# Altium schematic sheet LED Driver 8W.SchDoc
size 420 x 297 mm; CheckedBy: Lazarev; SheetTotal: 1; PageSetup: Record=PageOptions|CenterHorizontal=True|CenterVertical=True|PrintScale=1.44|XCorrection=1.00|YCorrection=1.00|PrintKind=0|BorderSize=5000000|LeftOffset=0|BottomOffset=0|Orientation=2|PaperLength=1000|PaperWidth=1000|Scale=100|PaperSource=260|PrintQuality=600|MediaType=1|DitherType=10|PrintScaleMode=1|PaperKind=A1|PaperIndex=120
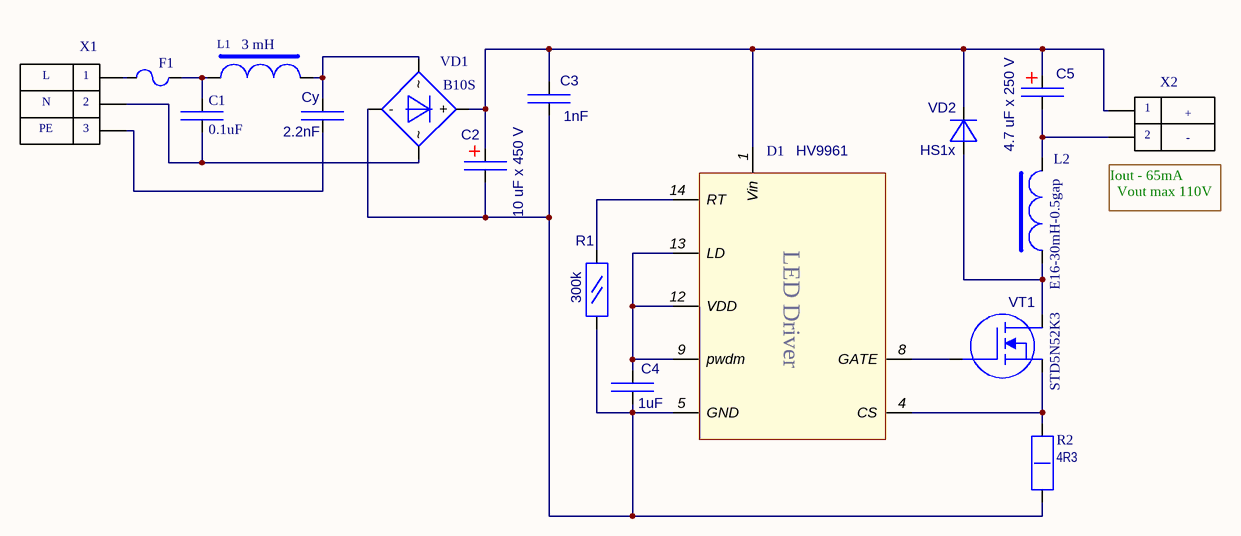
[diagram p0: LED Driver 8W.SchDoc]

## Parts
C1  value 0.1uF  [CAPR6.0x13.0-10.0 (MKP-104K0305AB1101-P)]  (hidden comment: Cap1)
C2  value 10 uF x 450 V  [CAPR E 12.5x20, pitch 5mm; hor.]  (hidden comment: Cap Pol)
C3  value 1nF  [CAPR5.0x13.0-5.0]  (hidden comment: Cap1)
C4  value 1uF  [CAPC2012 (0805)]  (hidden comment: Cap_SMD)
C5  value 4.7 uF x 250 V  [CAPR E 10x12.5 pitch 5 - hor]  (hidden comment: Cap Pol)
Cy  value 2.2nF  [CAPR Y - 7.5]  (hidden comment: Cap (Y))
D1  value HV9961  [SOIC127P602-16BN]  (hidden comment: HV9961 (SO16))
F1  Fuse3  [Fuse - PCB]  (value not drawn)  (net tie, no BOM)
L1  3 mH  [Choke Barbell]
L2  Value2: E16-30mH-0.5gap  [VRI-E16-8-G]  (hidden comment: LED.E16-30mH-0.5g-H)
R1  value 300k  [RESC2012(0805)]  (hidden comment: Res 1/8W)
R2  value 4R3  [RESC6332]  (hidden comment: Res 1W_1)
VD1  value B10S  [DB1-MS]  (hidden comment: Diode Bridge)
VD2  value HS1x  [CD4532-1812 (mod)]  (hidden comment: Diode HS1x)
VT1  Value2: STD5N52K3  [D-PAK (TO252)]  (hidden comment: FQD5N50)
X1  Connector_3_pin  [ZIP-Ballast3]  (value not drawn)
X2  Connector_output_2pin_nobody  [ZIP-Ballast2]  (value not drawn)

## Nets
NetC1_1: C1.1 VD1.2 X1.2
NetC1_2: C1.2 F1.1 L1.1(Pri+)
NetC2_1: C2.1 C3.2 C5.1 D1.1(Vin) VD1.3(+) VD2.2 X2.1
NetC2_2: C2.2 C3.1 C4.2 D1.5(GND) R1.1 R2.2 VD1.4(-)
NetC4_1: C4.1 D1.9(pwdm) D1.12(VDD) D1.13(LD)
NetC5_2: C5.2 L2.1(Pri-) X2.2
NetCy_1: Cy.1 X1.3
NetCy_2: Cy.2 L1.2(Pri-) VD1.1
NetD1_4: D1.4(CS) R2.1 VT1.3(S)
NetD1_8: D1.8(GATE) VT1.1(G)
NetD1_14: D1.14(RT) R1.2
NetF1_1: F1.1 X1.1
NetL2_14: L2.14(Pri+) VD2.1 VT1.2(D)

## Notes on the sheet
- (near X2) Iout - 65mA
  Vout max 110V
- Подп. дата
- Инв. № дубл.
- Взам. инв. №
- Подп. и дата
- Изм.
- Лист.
- № докум.
- Подп.
- Дата
- Лит.
- Масса
- Масштаб
- Разраб.
- Пров.
- Т. контр.
- Лист 1
- Листов
- 1:1
- Инв. № подп.
- Н. контр.
- Утв.
- (in symbol Connector_3_pin) L; N; PE
- (in symbol Connector_output_2pin_nobody) +; -
- (in symbol HV9961 (SO16)) LED Driver

## Library data of the parts
C1 = Cap1: Capacitor GOST; Voltage: 275VAC; Function: EMI X2-class Capacitor; PackageDescription: Radial Capacitor; Package Reference: Thru-Hole, Pin spacing 7.5mm; Part Number: *; Tolerance %: *; Supplier: *; Supplier Part Number: *
C2 C5 = Cap Pol: Cap Pol GOST; Tolerance: 10%; Function: Electrolytic Aluminum Capasitor; Supplier: *
  C2: PackageDescription: Radial, Thru-Hole Body 13.0x25.0 (DxH)mm, Pin Spacing 5.0mm
  C5: PackageDescription: Radial, Thru-Hole Body 10.0x13.5 (DxH)mm, Pin Spacing 5.0mm
C3 = Cap1: Capacitor GOST; Voltage: 1kV; Tolerance: 10 %; Dielectrik: Polypropyline; PackageDescription: Radial Capacitor; Package Reference: Capacitor class X 2,Thru-Hole Body 5.0 x 13.0 mm (WxT) Pin Spacing 5.0 mm; Function: *; Part Number: *; Supplier: *; Supplier Part Number: *
C4 = Cap_SMD: Ceramic; Voltage: 25V; Tolerance %: 10%; Dielectric: X7R; PackageDescription: SMD CC0805; Function: *; Supplier: *; Supplier Part Number: *
Cy = Cap (Y): Disc Ceramic; Voltage: 275VAC/400VDV; Function: Y-capacitor; Tolerance %: 20%; Dielectric: Ceramic Y1-class; PackageDescription: Radial, Disc Body , Pin Spacing 7.5mm; Supplier 1: *; Supplier Part Number 1: *
D1 = HV9961 (SO16): IC LED Driver Buck; Functuion: LED-Driver Controller; PackageReference: SOIC16; Supplier 1: Digi-Key; Supplier 2: Digi-Key; Supplier Part Number 2: HV9961NG-G-M901DKR-ND
F1 = Fuse3: Fuse GOST
L1 = Choke Barbell: Barbell 10 mm(d); PartNumber: IPK1016K302TU; Function: Choke EMI; PackageDescription: Barbell 11mm D; Value: 3 mH
L2 = Choke LED E16: LED.E16-30mH-0.5g.H; Function: Choke Ballast; PackageDescription: EVD25-13; Value: LED.E16-30mH-0.5g-H
R1 = Res 1/8W: Resistor GOST; Tolerance: 5%; PackageDescription: Chip Resistor, Body 2.0x1.3mm,; PackageReference: *; Part Number: *
R2 = Res 1W_1: Resistor GOST; Function: R Sence; Tolerance: 5%; Power rating: 1W; PackageDescription: Chip Resistor 2512; PackageReference: *; Part Number: *
VD1 = Diode Bridge: Diode Bridge GOST; PackageReference: *; PackageDescription: *; Part Number: *; Function: Diode Bridge; Supplier 1: Mouser; Supplier Part Number 1: Texas Inst.
VD2 = Diode HS1x: Diode HS1x (GOST); Package Description: Chip Diode; Body 4.5 x 3.2 mm (LxW typ); Part Number: *; Function: *
VT1 = FQD5N50: MOSFET N-channel (GOST); Value: STD9NM60N; Function: MOSFET N-channel 650V/0.75Ohm/6.5A; Part Number: *; Package Description: D-PAK (TO-252); Package Reference: *